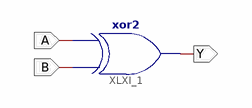
[diagram p0: schematic sheet 1]
// Xilinx ISE schematic Compuerta.sch (spartan3e) as structural Verilog: 1 symbols, 3 ports
module Compuerta (
  input  A,
  input  B,
  output Y
);

  xor XLXI_1 (Y, B, A);
endmodule
